# Altium schematic sheet 云台扩展板.SchDoc
size A0
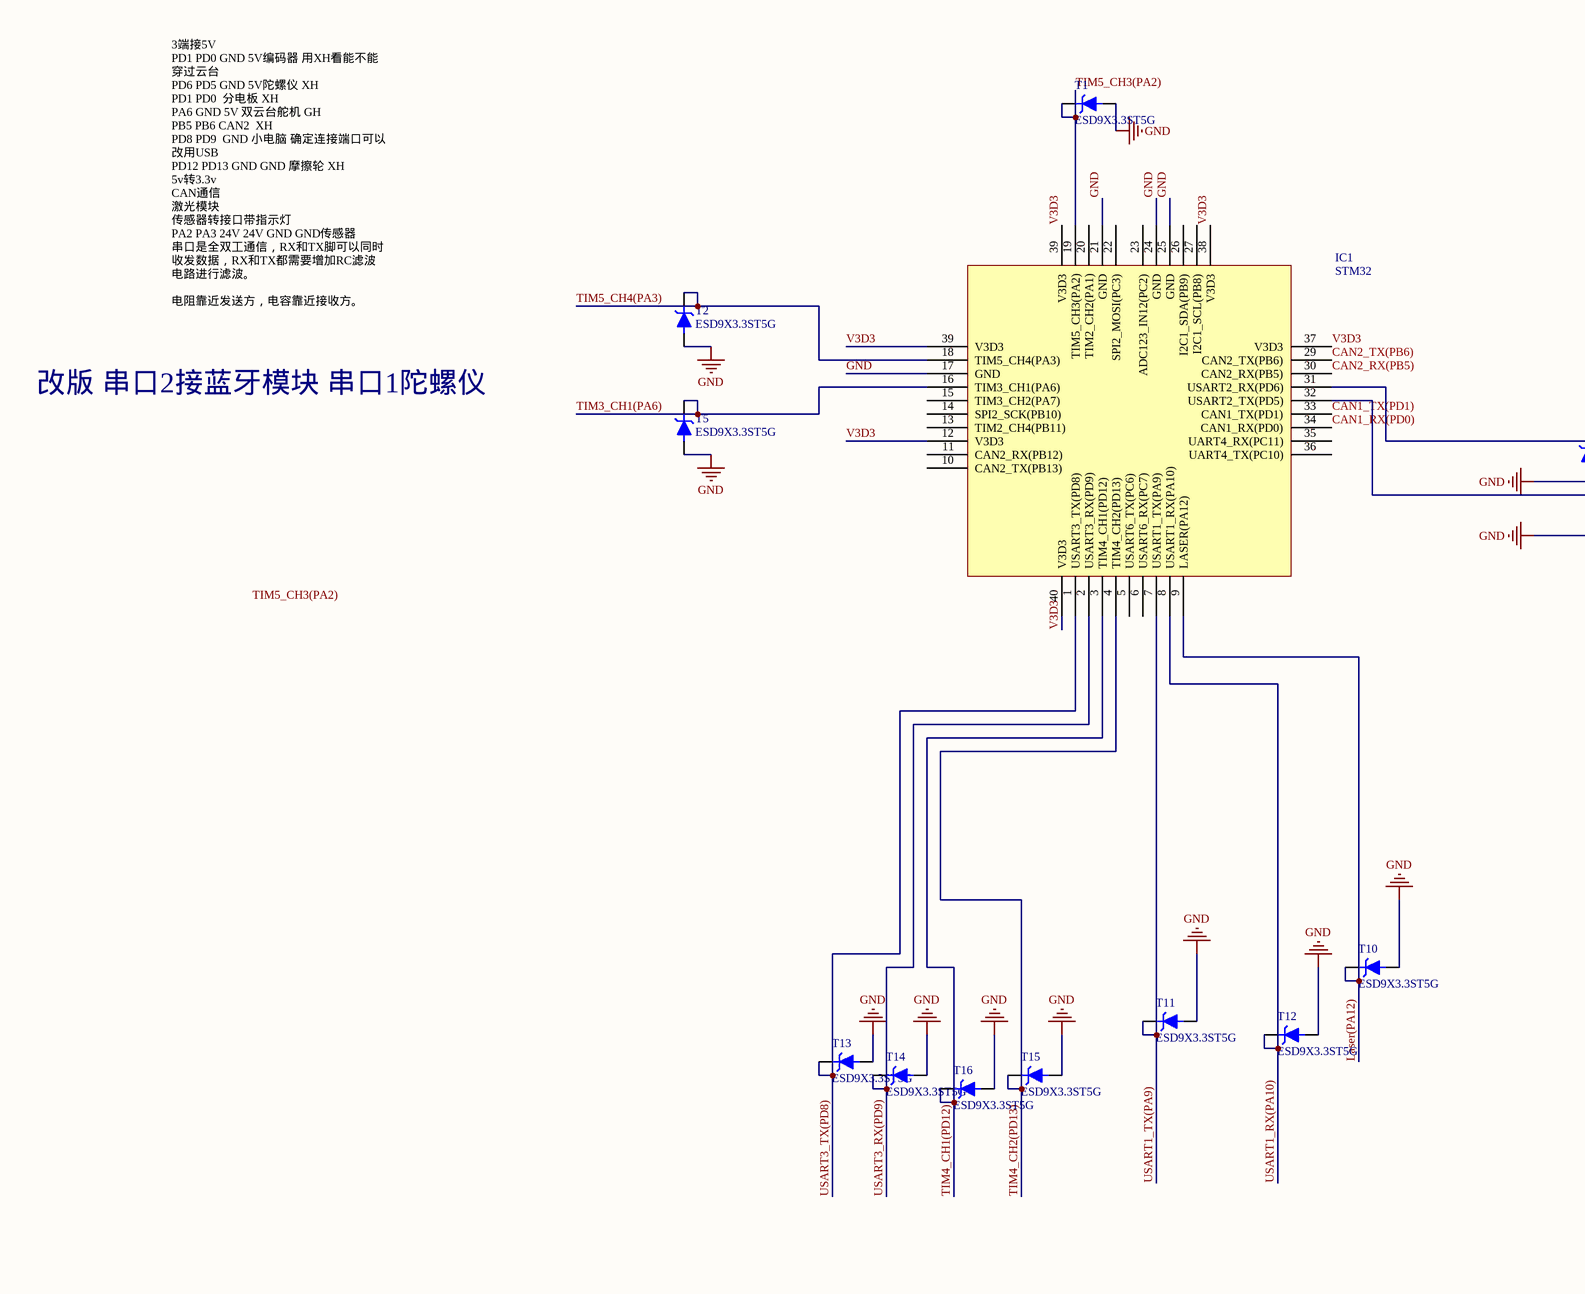
[diagram p0: 云台扩展板.SchDoc, left]
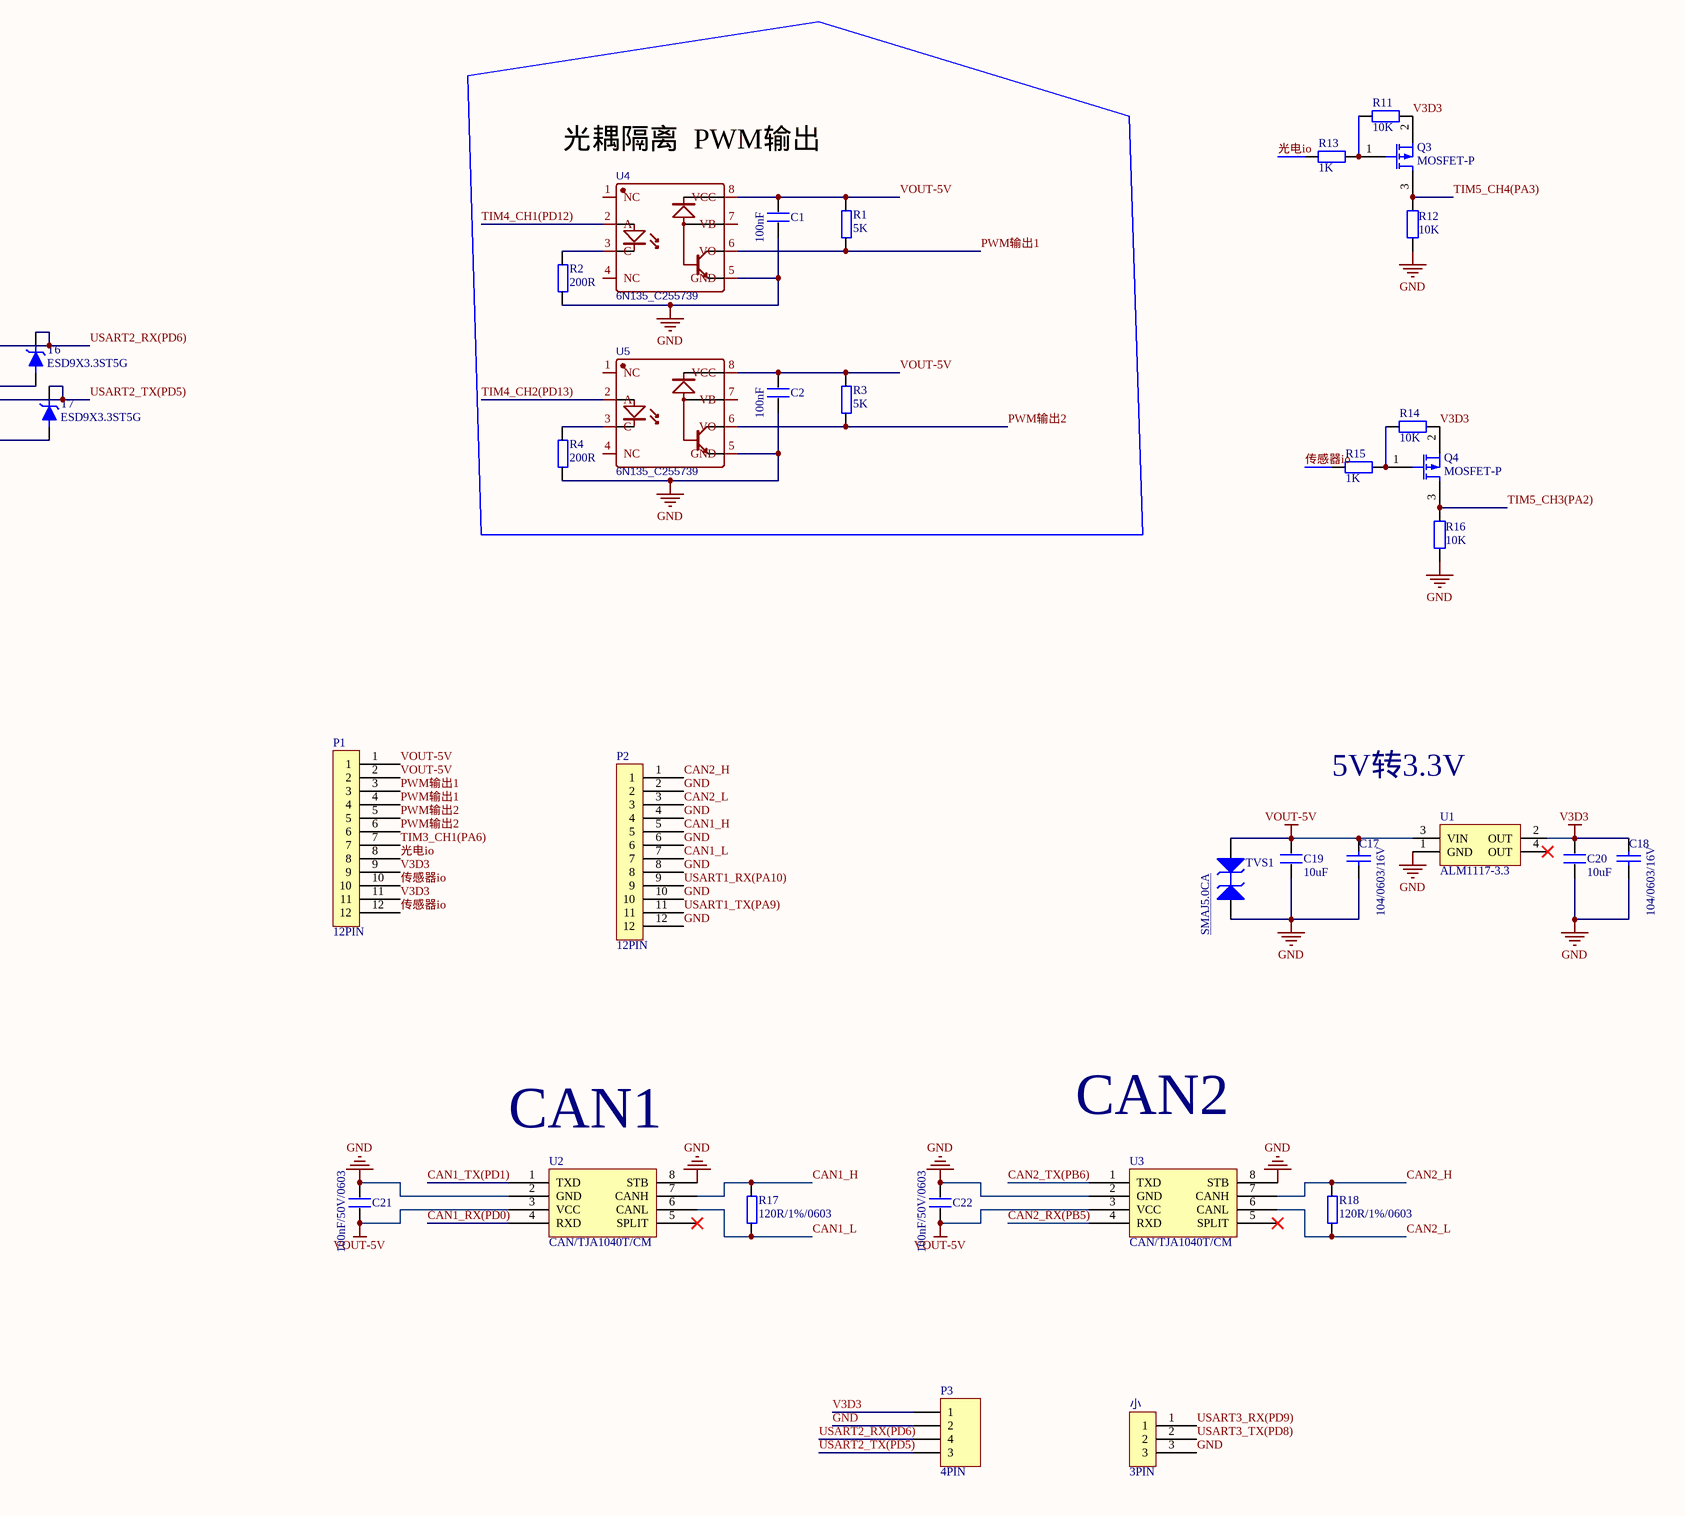
[diagram p1: 云台扩展板.SchDoc, right]

## Parts
C1  100nF  [0603_C]
C2  100nF  [0603_C]
C17  104/0603/16V  [C0805]
C18  104/0603/16V  [C0805]
C19  10uF  [C0805]
C20  10uF  [C0805]
C21  100nF/50V/0603  [C0805]
C22  100nF/50V/0603  [C0805]
IC1  STM32  [STM]
P1  12PIN  [12pin]
P2  12PIN  [12pin]
P3  4PIN  [HDR1X4]
Q3  MOSFET-P  [SOT-23(SOT-23-3)]
Q4  MOSFET-P  [SOT-23(SOT-23-3)]
R1  5K  [0603_R]
R2  200R  [0603_R]
R3  5K  [0603_R]
R4  200R  [0603_R]
R11  value 10K  [0603_R]  (hidden comment: Res2)
R12  value 10K  [0603_R]  (hidden comment: Res2)
R13  value 1K  [0603_R]  (hidden comment: Res2)
R14  value 10K  [0603_R]  (hidden comment: Res2)
R15  value 1K  [0603_R]  (hidden comment: Res2)
R16  value 10K  [0603_R]  (hidden comment: Res2)
R17  120R/1%/0603  [0603 R]
R18  120R/1%/0603  [0603 R]
T1  ESD9X3.3ST5G  [ESD9X3.3ST5G]
T2  ESD9X3.3ST5G  [ESD9X3.3ST5G]
T5  ESD9X3.3ST5G  [ESD9X3.3ST5G]
T6  ESD9X3.3ST5G  [ESD9X3.3ST5G]
T7  ESD9X3.3ST5G  [ESD9X3.3ST5G]
T10  ESD9X3.3ST5G  [ESD9X3.3ST5G]
T11  ESD9X3.3ST5G  [ESD9X3.3ST5G]
T12  ESD9X3.3ST5G  [ESD9X3.3ST5G]
T13  ESD9X3.3ST5G  [ESD9X3.3ST5G]
T14  ESD9X3.3ST5G  [ESD9X3.3ST5G]
T15  ESD9X3.3ST5G  [ESD9X3.3ST5G]
T16  ESD9X3.3ST5G  [ESD9X3.3ST5G]
TVS1  SMAJ5.0CA  [SMA(DO-214AC)_S1]
U1  ALM1117-3.3  [SOT-223]
U2  CAN/TJA1040T/CM  [CAN/TJA1040T/CM]
U3  CAN/TJA1040T/CM  [CAN/TJA1040T/CM]
U4  6N135_C255739  [DIP-8]
U5  6N135_C255739  [DIP-8]
小  3PIN  [XH2.54-3]

## Blocks framed on the sheet
光耦隔离  PWM输出: C1 C2 R1-R4 U4 U5

## Nets
GND: C1.1 C2.1 C17.1 C18.1 C19.1 C20.1 C21.2 C22.2 IC1.17(GND) IC1.21(GND) IC1.24(GND) IC1.25(GND) P2.2 P2.4 P2.6 P2.8 P2.10 P2.12 P3.2 R2.1 R4.1 R12.2 R16.2 T1.1(A) T2.1(A) T5.1(A) T6.1(A) T7.1(A) T10.1(A) T11.1(A) T12.1(A) T13.1(A) T14.1(A) T15.1(A) T16.1(A) TVS1.1(A) U1.1(GND) U2.2(GND) U2.8(STB) U3.2(GND) U3.8(STB) U4.5(GND) U5.5(GND) 小.3
V3D3: C18.2 C20.2 IC1.12(V3D3) IC1.37(V3D3) IC1.38(V3D3) IC1.39(V3D3) IC1.40(V3D3) P1.9 P1.11 P3.1 Q3.2(S) Q4.2(S) R11.1 R14.1 U1.2(OUT)
VOUT-5V: C1.2 C2.2 C17.2 C19.2 C21.1 C22.1 P1.1 P1.2 R1.2 R3.2 TVS1.2(K) U1.3(VIN) U2.3(VCC) U3.3(VCC) U4.8(VCC) U5.8(VCC)
CAN1_H: P2.5 R17.2 U2.7(CANH)
CAN1_L: P2.7 R17.1 U2.6(CANL)
CAN1_RX(PD0): IC1.34(CAN1_RX(PD0)) U2.4(RXD)
CAN1_TX(PD1): IC1.33(CAN1_TX(PD1)) U2.1(TXD)
CAN2_H: P2.1 R18.2 U3.7(CANH)
CAN2_L: P2.3 R18.1 U3.6(CANL)
CAN2_RX(PB5): IC1.30(CAN2_RX(PB5)) U3.4(RXD)
CAN2_TX(PB6): IC1.29(CAN2_TX(PB6)) U3.1(TXD)
Laser(PA12): IC1.9(LASER(PA12)) T10.2(K)
PWM输出1: P1.3 P1.4 R1.1 U4.6(VO)
PWM输出2: P1.5 P1.6 R3.1 U5.6(VO)
TIM3_CH1(PA6): IC1.16(TIM3_CH1(PA6)) P1.7 T5.2(K)
TIM4_CH1(PD12): IC1.3(TIM4_CH1(PD12)) T16.2(K) U4.2(A)
TIM4_CH2(PD13): IC1.4(TIM4_CH2(PD13)) T15.2(K) U5.2(A)
TIM5_CH3(PA2): IC1.19(TIM5_CH3(PA2)) Q4.3(D) R16.1 T1.2(K)
TIM5_CH4(PA3): IC1.18(TIM5_CH4(PA3)) Q3.3(D) R12.1 T2.2(K)
USART1_RX(PA10): IC1.8(USART1_RX(PA10)) P2.9 T12.2(K)
USART1_TX(PA9): IC1.7(USART1_TX(PA9)) P2.11 T11.2(K)
USART2_RX(PD6): IC1.31(USART2_RX(PD6)) P3.4 T6.2(K)
USART2_TX(PD5): IC1.32(USART2_TX(PD5)) P3.3 T7.2(K)
USART3_RX(PD9): IC1.2(USART3_RX(PD9)) T14.2(K) 小.1
USART3_TX(PD8): IC1.1(USART3_TX(PD8)) T13.2(K) 小.2
传感器io: P1.10 P1.12 R15.2
光电io: P1.8 R13.2
NetQ3_1: Q3.1(G) R11.2 R13.1
NetQ4_1: Q4.1(G) R14.2 R15.1
NetR2_2: R2.2 U4.3(C)
NetR4_2: R4.2 U5.3(C)

Not connected (* = marked no-connect by the designer): IC1 5(USART6_TX(PC6)) 6(USART6_RX(PC7)) 10(CAN2_TX(PB13)) 11(CAN2_RX(PB12)) 13(TIM2_CH4(PB11)) 14(SPI2_SCK(PB10)) 15(TIM3_CH2(PA7)) 20(TIM2_CH2(PA1)) 22(SPI2_MOSI(PC3)) 23(ADC123_IN12(PC2)) 26(I2C1_SDA(PB9)) 27(I2C1_SCL(PB8)) 35(UART4_RX(PC11)) 36(UART4_TX(PC10)); U1 4(OUT)*; U2 5(SPLIT)*; U3 5(SPLIT)*; U4 1(NC) 4(NC) 7(VB); U5 1(NC) 4(NC) 7(VB)

## Notes on the sheet
- 3端接5V
  PD1 PD0 GND 5V编码器 用XH看能不能穿过云台
  PD6 PD5 GND 5V陀螺仪 XH
  PD1 PD0  分电板 XH
  PA6 GND 5V 双云台舵机 GH
  PB5 PB6 CAN2  XH
  PD8 PD9  GND 小电脑 确定连接端口可以改用USB
  PD12 PD13 GND GND 摩擦轮 XH
  5v转3.3v
  CAN通信
  激光模块
  传感器转接口带指示灯
  PA2 PA3 24V 24V GND GND传感器
  串口是全双工通信，RX和TX脚可以同时收发数据，RX和TX都需要增加RC滤波电路进行滤波。
  电阻靠近发送方，电容靠近接收方。
- 改版 串口2接蓝牙模块 串口1陀螺仪
- 5V转3.3V
- (near U2) CAN1
- CAN2
- Labels drawn without touching a wire or pin: TIM5_CH3(PA2)

## Library data of the parts
C1 C2 C19-C22 = C
C17 C18 = CAP
IC1 = STM32_1
P3 = Header 4: Header, 4-Pin; LatestRevisionDate: 17-Jul-2002; LatestRevisionNote: Re-released for DXP Platform.; Publisher: Altium Limited
R1-R4 R17 R18 = R
R11-R16 = Res2: Resistor
T1 T2 T5-T7 T10-T16 TVS1 = TVS
U1 = LM1117-3.3
U2 U3 = CAN/TJA1040T/CM_[C6951]: CAN; ComponentLink1Description: 供应商链接; ComponentLink1URL: http://www.szlcsc.com/product/details_7423.html; Package: SOIC-8_150mil; Supplier: LC; SuppliersPartNumber: C6951
U4 U5 = 6N135_C255739: BOM_Manufacturer: Isocom Components; BOM_Manufacturer Part: 6N135; Contributor: LCSC; BOM_Supplier: LCSC; BOM_Supplier Part: C255739; spicePre: U; spiceSymbolName: 6N135_C255739